# Altium project OIS_Anakart.PrjPcb (part 2 of 2)
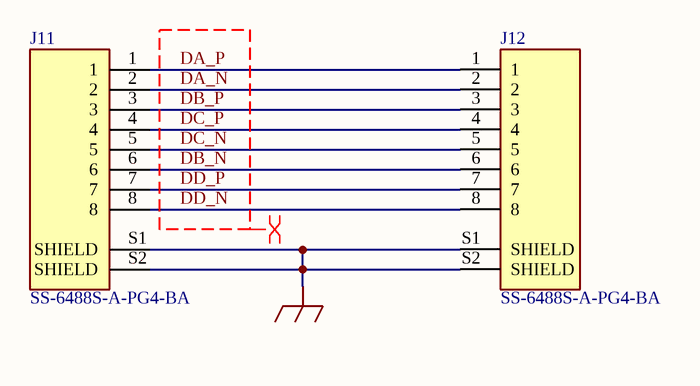
[diagram p10: Ethernet.SchDoc]

## Nets that join several sheets
+3V3: OIS_Anakart (J1.4 R1.1 R36.1 R37.1), U_DIGITAL_INPUT_2CH_1 (C18_U_DIGITAL_INPUT_2CH_1.2 R19_U_DIGITAL_INPUT_2CH_1.2 R21_U_DIGITAL_INPUT_2CH_1.2 U6_U_DIGITAL_INPUT_2CH_1.5), Connector (J9.1), ESP (J4.P8 J5.1 LS1.P), Power (C14.2 C16.2 U5.2), ADC_1W (7 pins), U_DIGITAL_INPUT_2CH_2 (C18_U_DIGITAL_INPUT_2CH_2.2 R19_U_DIGITAL_INPUT_2CH_2.2 R21_U_DIGITAL_INPUT_2CH_2.2 U6_U_DIGITAL_INPUT_2CH_2.5), U_DIGITAL_INPUT_2CH_3 (C18_U_DIGITAL_INPUT_2CH_3.2 R19_U_DIGITAL_INPUT_2CH_3.2 R21_U_DIGITAL_INPUT_2CH_3.2 U6_U_DIGITAL_INPUT_2CH_3.5), U_DIGITAL_INPUT_2CH_4 (C18_U_DIGITAL_INPUT_2CH_4.2 R19_U_DIGITAL_INPUT_2CH_4.2 R21_U_DIGITAL_INPUT_2CH_4.2 U6_U_DIGITAL_INPUT_2CH_4.5), U_DIGITAL_INPUT_2CH_5 (C18_U_DIGITAL_INPUT_2CH_5.2 R19_U_DIGITAL_INPUT_2CH_5.2 R21_U_DIGITAL_INPUT_2CH_5.2 U6_U_DIGITAL_INPUT_2CH_5.5)
+5V: OIS_Anakart (5 pins), Power (5 pins)
+5V_IO: U_DIGITAL_OUTPUT_2CH_1 (JMP2_U_DIGITAL_OUTPUT_2CH_1.3), U_DIGITAL_OUTPUT_2CH_2 (JMP2_U_DIGITAL_OUTPUT_2CH_2.3), U_DIGITAL_OUTPUT_2CH_3 (JMP2_U_DIGITAL_OUTPUT_2CH_3.3), U_DIGITAL_OUTPUT_2CH_4 (JMP2_U_DIGITAL_OUTPUT_2CH_4.3), Connector (8 pins), Power (R12.2 SB2.2), U_DIGITAL_OUTPUT_2CH_5 (JMP2_U_DIGITAL_OUTPUT_2CH_5.3), U_DIGITAL_OUTPUT_2CH_6 (JMP2_U_DIGITAL_OUTPUT_2CH_6.3), U_DIGITAL_OUTPUT_2CH_7 (JMP2_U_DIGITAL_OUTPUT_2CH_7.3), U_DIGITAL_OUTPUT_2CH_8 (JMP2_U_DIGITAL_OUTPUT_2CH_8.3)
+12V: OIS_Anakart (J10.1), U_DIGITAL_OUTPUT_2CH_1 (JMP2_U_DIGITAL_OUTPUT_2CH_1.1), U_DIGITAL_OUTPUT_2CH_2 (JMP2_U_DIGITAL_OUTPUT_2CH_2.1), U_DIGITAL_OUTPUT_2CH_3 (JMP2_U_DIGITAL_OUTPUT_2CH_3.1), U_DIGITAL_OUTPUT_2CH_4 (JMP2_U_DIGITAL_OUTPUT_2CH_4.1), U_Relay/U_OIS_Relay (D6_U_Relay_U_OIS_Relay#1.A D7_U_Relay_U_OIS_Relay#1.C K1_U_Relay_U_OIS_Relay#1.2 Q2_U_Relay_U_OIS_Relay#1.6), U_Relay/U_OIS_Relay (D6_U_Relay_U_OIS_Relay#2.A D7_U_Relay_U_OIS_Relay#2.C K1_U_Relay_U_OIS_Relay#2.2 Q2_U_Relay_U_OIS_Relay#2.6), Connector (9 pins), Power (10 pins), U_DIGITAL_OUTPUT_2CH_5 (JMP2_U_DIGITAL_OUTPUT_2CH_5.1), U_DIGITAL_OUTPUT_2CH_6 (JMP2_U_DIGITAL_OUTPUT_2CH_6.1), U_DIGITAL_OUTPUT_2CH_7 (JMP2_U_DIGITAL_OUTPUT_2CH_7.1), U_DIGITAL_OUTPUT_2CH_8 (JMP2_U_DIGITAL_OUTPUT_2CH_8.1)
GND: OIS_Anakart (22 pins), U_DIGITAL_INPUT_2CH_1 (6 pins), U_DIGITAL_OUTPUT_2CH_1 (D8_U_DIGITAL_OUTPUT_2CH_1.C R25_U_DIGITAL_OUTPUT_2CH_1.1 U7_U_DIGITAL_OUTPUT_2CH_1.4), U_DIGITAL_OUTPUT_2CH_2 (D8_U_DIGITAL_OUTPUT_2CH_2.C R25_U_DIGITAL_OUTPUT_2CH_2.1 U7_U_DIGITAL_OUTPUT_2CH_2.4), U_DIGITAL_OUTPUT_2CH_3 (D8_U_DIGITAL_OUTPUT_2CH_3.C R25_U_DIGITAL_OUTPUT_2CH_3.1 U7_U_DIGITAL_OUTPUT_2CH_3.4), U_DIGITAL_OUTPUT_2CH_4 (D8_U_DIGITAL_OUTPUT_2CH_4.C R25_U_DIGITAL_OUTPUT_2CH_4.1 U7_U_DIGITAL_OUTPUT_2CH_4.4), U_Relay/U_OIS_Relay (Q2_U_Relay_U_OIS_Relay#1.3 Q3_U_Relay_U_OIS_Relay#1.2), U_Relay/U_OIS_Relay (Q2_U_Relay_U_OIS_Relay#2.3 Q3_U_Relay_U_OIS_Relay#2.2), Connector (22 pins), ESP (6 pins), Power (23 pins), ADC_1W (16 pins), U_DIGITAL_OUTPUT_2CH_5 (D8_U_DIGITAL_OUTPUT_2CH_5.C R25_U_DIGITAL_OUTPUT_2CH_5.1 U7_U_DIGITAL_OUTPUT_2CH_5.4), U_DIGITAL_OUTPUT_2CH_6 (D8_U_DIGITAL_OUTPUT_2CH_6.C R25_U_DIGITAL_OUTPUT_2CH_6.1 U7_U_DIGITAL_OUTPUT_2CH_6.4), U_DIGITAL_OUTPUT_2CH_7 (D8_U_DIGITAL_OUTPUT_2CH_7.C R25_U_DIGITAL_OUTPUT_2CH_7.1 U7_U_DIGITAL_OUTPUT_2CH_7.4), U_DIGITAL_OUTPUT_2CH_8 (D8_U_DIGITAL_OUTPUT_2CH_8.C R25_U_DIGITAL_OUTPUT_2CH_8.1 U7_U_DIGITAL_OUTPUT_2CH_8.4), U_DIGITAL_INPUT_2CH_2 (6 pins), U_DIGITAL_INPUT_2CH_3 (6 pins), U_DIGITAL_INPUT_2CH_4 (6 pins), U_DIGITAL_INPUT_2CH_5 (C18_U_DIGITAL_INPUT_2CH_5.1 Q4_U_DIGITAL_INPUT_2CH_5.4 Q5_U_DIGITAL_INPUT_2CH_5.4 U6_U_DIGITAL_INPUT_2CH_5.2)
ADC0: Connector (P5.1), ADC_1W (C20.2 R27.2)
ADC1: Connector (P5.3), ADC_1W (C22.2 R29.2)
ADC2: Connector (P5.5), ADC_1W (C26.2 R31.2)
ADC3: Connector (P5.7), ADC_1W (C28.2 R34.2)
ADC_SCL: OIS_Anakart (J1.5 J2.4 R37.2), ADC_1W (U8.4 U9.10)
ADC_SDA: OIS_Anakart (J1.6 J2.3 R36.2), ADC_1W (U8.5 U9.9)
COMMON: U_Relay/U_OIS_Relay (K1_U_Relay_U_OIS_Relay#1.1), Connector (P3.2)
COMMON: U_Relay/U_OIS_Relay (K1_U_Relay_U_OIS_Relay#2.1), Connector (P3.5)
DIN1_P: Connector (J8.1_P1), U_DIGITAL_INPUT_2CH_4 (R22_U_DIGITAL_INPUT_2CH_4.2)
DIN2_P: Connector (J8.1_P2), U_DIGITAL_INPUT_2CH_2 (R22_U_DIGITAL_INPUT_2CH_2.2)
DIN3_P: Connector (J8.1_P3), U_DIGITAL_INPUT_2CH_4 (R20_U_DIGITAL_INPUT_2CH_4.2)
DIN4_P: Connector (J8.1_P4), U_DIGITAL_INPUT_2CH_2 (R20_U_DIGITAL_INPUT_2CH_2.2)
DIN5_P: Connector (J8.1_P5), U_DIGITAL_INPUT_2CH_3 (R22_U_DIGITAL_INPUT_2CH_3.2)
DIN6_P: U_DIGITAL_INPUT_2CH_1 (R22_U_DIGITAL_INPUT_2CH_1.2), Connector (J8.1_P6)
DIN7_P: Connector (J8.1_P7), U_DIGITAL_INPUT_2CH_3 (R20_U_DIGITAL_INPUT_2CH_3.2)
DIN8_P: U_DIGITAL_INPUT_2CH_1 (R20_U_DIGITAL_INPUT_2CH_1.2), Connector (J8.1_P8)
DIN9_N: Connector (P2.2), U_DIGITAL_INPUT_2CH_5 (Q5_U_DIGITAL_INPUT_2CH_5.3)
DIN9_P: Connector (P2.1), U_DIGITAL_INPUT_2CH_5 (R22_U_DIGITAL_INPUT_2CH_5.2)
DIN10_N: Connector (P2.4), U_DIGITAL_INPUT_2CH_5 (Q4_U_DIGITAL_INPUT_2CH_5.3)
DIN10_P: Connector (P2.3), U_DIGITAL_INPUT_2CH_5 (R20_U_DIGITAL_INPUT_2CH_5.2)
DO1: U_DIGITAL_OUTPUT_2CH_1 (Q6_U_DIGITAL_OUTPUT_2CH_1.3 R26_U_DIGITAL_OUTPUT_2CH_1.2), Connector (J8.3_P2)
DO2: U_DIGITAL_OUTPUT_2CH_2 (Q6_U_DIGITAL_OUTPUT_2CH_2.3 R26_U_DIGITAL_OUTPUT_2CH_2.2), Connector (J8.3_P1)
DO3: U_DIGITAL_OUTPUT_2CH_3 (Q6_U_DIGITAL_OUTPUT_2CH_3.3 R26_U_DIGITAL_OUTPUT_2CH_3.2), Connector (J8.3_P4)
DO4: U_DIGITAL_OUTPUT_2CH_4 (Q6_U_DIGITAL_OUTPUT_2CH_4.3 R26_U_DIGITAL_OUTPUT_2CH_4.2), Connector (J8.3_P3)
DO5: Connector (J8.3_P6), U_DIGITAL_OUTPUT_2CH_5 (Q6_U_DIGITAL_OUTPUT_2CH_5.3 R26_U_DIGITAL_OUTPUT_2CH_5.2)
DO6: Connector (J8.3_P5), U_DIGITAL_OUTPUT_2CH_6 (Q6_U_DIGITAL_OUTPUT_2CH_6.3 R26_U_DIGITAL_OUTPUT_2CH_6.2)
DO7: Connector (J8.3_P8), U_DIGITAL_OUTPUT_2CH_7 (Q6_U_DIGITAL_OUTPUT_2CH_7.3 R26_U_DIGITAL_OUTPUT_2CH_7.2)
DO8: Connector (J8.3_P7), U_DIGITAL_OUTPUT_2CH_8 (Q6_U_DIGITAL_OUTPUT_2CH_8.3 R26_U_DIGITAL_OUTPUT_2CH_8.2)
DS_IO: Connector (8 pins), ADC_1W (Q7.3 U8.2)
ESP_SCL: OIS_Anakart (J2.6), ESP (J4.P13 J5.2)
ESP_SDA: OIS_Anakart (J2.5), ESP (J4.P14 J5.3)
GPIO0: OIS_Anakart (U1.27), U_DIGITAL_OUTPUT_2CH_4 (U7_U_DIGITAL_OUTPUT_2CH_4.1)
GPIO1: OIS_Anakart (U1.28), U_DIGITAL_OUTPUT_2CH_6 (U7_U_DIGITAL_OUTPUT_2CH_6.1)
GPIO4: OIS_Anakart (U1.7), U_DIGITAL_INPUT_2CH_4 (U6_U_DIGITAL_INPUT_2CH_4.6)
GPIO5: OIS_Anakart (U1.29), U_DIGITAL_OUTPUT_2CH_2 (U7_U_DIGITAL_OUTPUT_2CH_2.1)
GPIO6: OIS_Anakart (U1.31), U_Relay/U_OIS_Relay (R16_U_Relay_U_OIS_Relay#1.1)
GPIO7: OIS_Anakart (U1.26), U_DIGITAL_OUTPUT_2CH_8 (U7_U_DIGITAL_OUTPUT_2CH_8.1)
GPIO8: OIS_Anakart (U1.24), U_DIGITAL_INPUT_2CH_5 (U6_U_DIGITAL_INPUT_2CH_5.6)
GPIO9: OIS_Anakart (U1.21), U_DIGITAL_INPUT_2CH_5 (U6_U_DIGITAL_INPUT_2CH_5.4)
GPIO10: OIS_Anakart (U1.19), U_DIGITAL_INPUT_2CH_3 (U6_U_DIGITAL_INPUT_2CH_3.4)
GPIO11: OIS_Anakart (U1.23), U_DIGITAL_INPUT_2CH_1 (U6_U_DIGITAL_INPUT_2CH_1.4)
GPIO12: OIS_Anakart (U1.32), U_Relay/U_OIS_Relay (R16_U_Relay_U_OIS_Relay#2.1)
GPIO13: OIS_Anakart (U1.33), U_DIGITAL_OUTPUT_2CH_7 (U7_U_DIGITAL_OUTPUT_2CH_7.1)
GPIO16: OIS_Anakart (U1.36), U_DIGITAL_OUTPUT_2CH_5 (U7_U_DIGITAL_OUTPUT_2CH_5.1)
GPIO17: OIS_Anakart (U1.11), U_DIGITAL_INPUT_2CH_4 (U6_U_DIGITAL_INPUT_2CH_4.4)
GPIO18: OIS_Anakart (U1.12), U_DIGITAL_INPUT_2CH_2 (U6_U_DIGITAL_INPUT_2CH_2.6)
GPIO19: OIS_Anakart (U1.35), U_DIGITAL_OUTPUT_2CH_3 (U7_U_DIGITAL_OUTPUT_2CH_3.1)
GPIO20: OIS_Anakart (U1.38), U_DIGITAL_OUTPUT_2CH_1 (U7_U_DIGITAL_OUTPUT_2CH_1.1)
GPIO22: OIS_Anakart (U1.15), U_DIGITAL_INPUT_2CH_3 (U6_U_DIGITAL_INPUT_2CH_3.6)
GPIO25: OIS_Anakart (U1.22), U_DIGITAL_INPUT_2CH_1 (U6_U_DIGITAL_INPUT_2CH_1.6)
GPIO27: OIS_Anakart (U1.13), U_DIGITAL_INPUT_2CH_2 (U6_U_DIGITAL_INPUT_2CH_2.4)
NC: U_Relay/U_OIS_Relay (K1_U_Relay_U_OIS_Relay#1.4), Connector (P3.3)
NC: U_Relay/U_OIS_Relay (K1_U_Relay_U_OIS_Relay#2.4), Connector (P3.6)
NO: U_Relay/U_OIS_Relay (K1_U_Relay_U_OIS_Relay#1.3), Connector (P3.1)
NO: U_Relay/U_OIS_Relay (K1_U_Relay_U_OIS_Relay#2.3), Connector (P3.4)
RTC_SCL: OIS_Anakart (J1.9 U1.5), Connector (J9.3)
RTC_SDA: OIS_Anakart (J1.10 U1.3), Connector (J9.2)